# Altium schematic sheet power-v12.SchDoc: Copper Suicide - Power 12V
size Letter; CheckedBy: J. Brinton; CompanyName: Signal Laboratories, Inc.; DrawnBy: J. Brinton; Engineer: J. Brinton; Address1: 3479 Edison Way; Address2: Menlo Park CA 94025; Address3: +1 (877) 778-8435; Address4: siglabs.com; Revision: 3; SheetNumber: 40; SheetTotal: 47
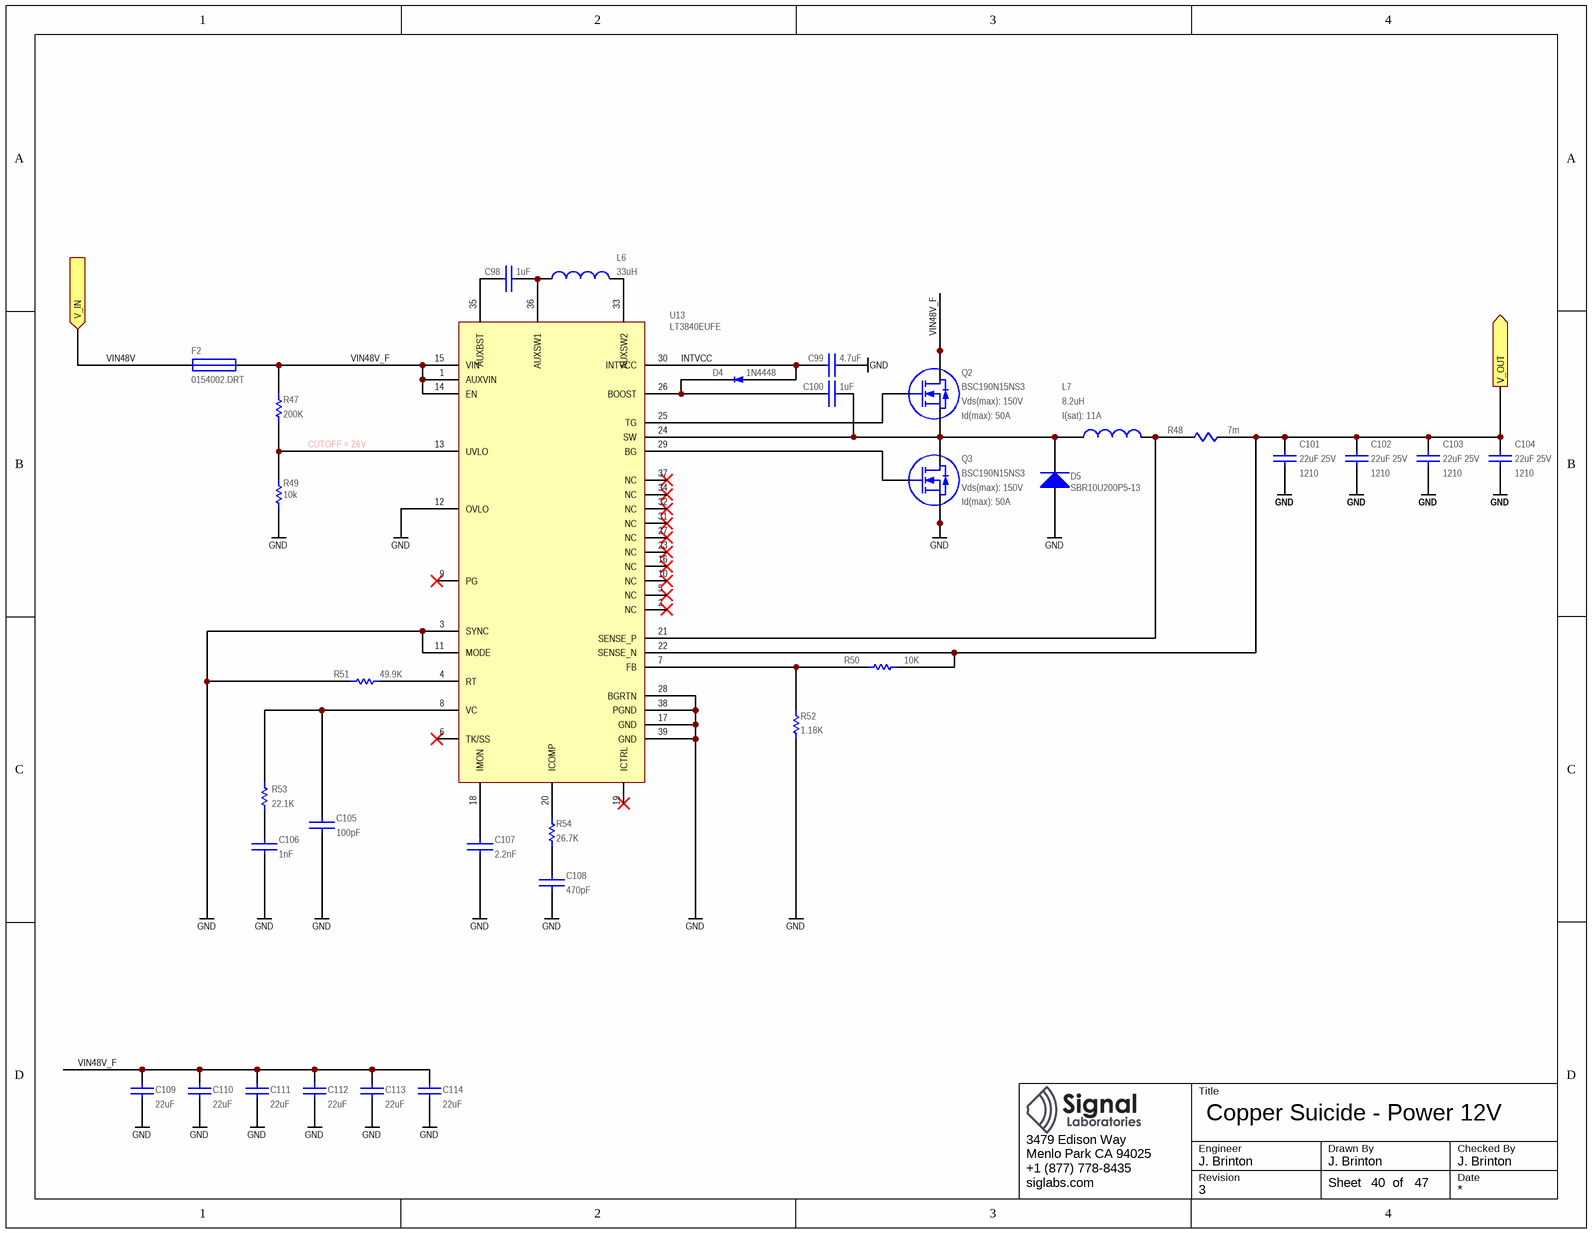
[diagram p0: power-v12.SchDoc]

## Parts
C98  value 1uF  [CAPC100X50X55L25N]  (hidden comment: GRM155R61A105KE15)
C99  value 4.7uF  [CAPC160X80X90L20N]  (hidden comment: GRM188R61E475KE11)
C100  value 1uF  [CAPC100X50X55L25N]  (hidden comment: GRM155R61A105KE15)
C101  value 22uF  Voltage: 25V  Package: 1210  [CAPC320X250X270L50N]  (hidden comment: GRM32ER71E226KE15)
C102  value 22uF  Voltage: 25V  Package: 1210  [CAPC320X250X270L50N]  (hidden comment: GRM32ER71E226KE15)
C103  value 22uF  Voltage: 25V  Package: 1210  [CAPC320X250X270L50N]  (hidden comment: GRM32ER71E226KE15)
C104  value 22uF  Voltage: 25V  Package: 1210  [CAPC320X250X270L50N]  (hidden comment: GRM32ER71E226KE15)
C105  value 100pF  [CAPC100X50X55L25N]  (hidden comment: GRM1555C1H101JA01)
C106  value 1nF  [CAPC100X50X55L25N]  (hidden comment: GRM1555C1H102JA01)
C107  value 2.2nF  [CAPC100X50X55L25N]  (hidden comment: C0402C222J3GACTU)
C108  value 470pF  [CAPC100X50X55L25N]  (hidden comment: GRM155R71H471JA01)
C109  value 22uF  [CAPC600X500X500L160N]  (hidden comment: CKG57NX7S1H226M500JJ)
C110  value 22uF  [CAPC600X500X500L160N]  (hidden comment: CKG57NX7S1H226M500JJ)
C111  value 22uF  [CAPC600X500X500L160N]  (hidden comment: CKG57NX7S1H226M500JJ)
C112  value 22uF  [CAPC600X500X500L160N]  (hidden comment: CKG57NX7S1H226M500JJ)
C113  value 22uF  [CAPC600X500X500L160N]  (hidden comment: CKG57NX7S1H226M500JJ)
C114  value 22uF  [CAPC600X500X500L160N]  (hidden comment: CKG57NX7S1H226M500JJ)
D4  Alternative P/N: 1N4448  [SOD323]  (hidden comment: 1N4448HWS-7-F)
D5  SBR10U200P5-13  [DIODES_POWERDI5]
F2  0154002.DRT  [154]
L6  value 33uH  [ME3220]  (hidden comment: ME3220-333KL)
L7  value 8.2uH  I(sat): 11A  [IND-1350]  (hidden comment: 7443550820)
Q2  BSC190N15NS3  Vds(max): 150V  Id(max): 50A  [TDSON-8]
Q3  BSC190N15NS3  Vds(max): 150V  Id(max): 50A  [TDSON-8]
R47  value 200K  [RESC1005X40N]  (hidden comment: ERJ-2RKF2003X)
R48  value 7m  [RESC3216X80L110N]  (hidden comment: CSR1206-0R007F1)
R49  value 10k  [RESC1005X40N]  (hidden comment: ERJ-2RKF1002X)
R50  value 10K  [RESC1005X40N]  (hidden comment: ERJ-2RKF1002X)
R51  value 49.9K  [RESC1005X40N]  (hidden comment: ERJ-2RKF4992X)
R52  value 1.18K  [RESC1005X40N]  (hidden comment: RC0402FR-071K18L)
R53  value 22.1K  [RESC1005X40N]  (hidden comment: ERJ-2RKF2212X)
R54  value 26.7K  [RESC1005X40N]  (hidden comment: ERJ-2RKF2672X)
U13  LT3840EUFE  [QFN39P40_600X400X80L40X20T465X265N]

## Ports
V_IN (in), V_OUT (out)

## Nets
GND: C99.2 C101.1 C102.1 C103.1 C104.1 C105.1 C106.2 C107.2 C108.1 C109.1 C110.1 C111.1 C112.1 C113.1 C114.1 D5.A Q3.1(S) Q3.2(S) Q3.3(S) R49.1 R51.2 R52.2 U13.3(SYNC) U13.11(MODE) U13.12(OVLO) U13.17(GND) U13.28(BGRTN) U13.38(PGND) U13.39(GND)
INTVCC: C99.1 D4.A U13.30(INTVCC)
V_OUT: C101.2 C102.2 C103.2 C104.2 R48.2 R50.2 U13.22(SENSE_N) ; port V_OUT
VIN48V: F2.1 ; port V_IN
VIN48V_F: C109.2 C110.2 C111.2 C112.2 C113.2 C114.2 F2.2 Q2.5(D) Q2.6(D) Q2.7(D) Q2.8(D) Q2.9(D) R47.2 U13.1(AUXVIN) U13.14(EN) U13.15(VIN)
NetC98_1: C98.1 L6.1 U13.36(AUXSW1)
NetC98_2: C98.2 U13.35(AUXBST)
NetC100_1: C100.1 D5.K L7.1 Q2.1(S) Q2.2(S) Q2.3(S) Q3.5(D) Q3.6(D) Q3.7(D) Q3.8(D) Q3.9(D) U13.24(SW)
NetC100_2: C100.2 D4.K U13.26(BOOST)
NetC105_2: C105.2 R53.2 U13.8(VC)
NetC106_1: C106.1 R53.1
NetC107_1: C107.1 U13.18(IMON)
NetC108_2: C108.2 R54.2
NetL6_2: L6.2 U13.33(AUXSW2)
NetL7_2: L7.2 R48.1 U13.21(SENSE_P)
NetQ2_4: Q2.4(G) U13.25(TG)
NetQ3_4: Q3.4(G) U13.29(BG)
NetR47_1: R47.1 R49.2 U13.13(UVLO)
NetR50_1: R50.1 R52.1 U13.7(FB)
NetR51_1: R51.1 U13.4(RT)
NetR54_1: R54.1 U13.20(ICOMP)

Not connected (* = marked no-connect by the designer): U13 2(NC)* 5(NC)* 6(TK/SS)* 9(PG)* 10(NC)* 16(NC)* 19(ICTRL)* 23(NC)* 27(NC)* 31(NC)* 32(NC)* 34(NC)* 37(NC)*

## Notes on the sheet
- CUTOFF = 26V
- Title
- Engineer
- Revision
- Drawn By
- Checked By
- Date
- Sheet
- of

## Library data of the parts
C98 C100 = CAP: Ceramic Capacitor 1uF ±10% 10V X5R 0402; Manufacturer: Murata; Tr: -55:125; Manufacturer P/N: GRM155R61A105KE15; Package: 0402; Tolerance: ±10%; Voltage: 10V
C99 = CAP 0603: Ceramic Capacitor 4.7uF ±10% 25V X5R 0603; Manufacturer: Murata; Tr: -55:85; Voltage: 25V; Manufacturer P/N: GRM188R61E475KE11; Package: 0603; Tolerance: ±10%
C101-C104 = CAP: Ceramic Capacitor 22uF ±10% 25V X7R 1210; Manufacturer: Murata; Tr: -55:125; Manufacturer P/N: GRM32ER71E226KE15; Tolerance: ±10%
C105 = CAP: Ceramic Capacitor 100pF ±5% 50V NP0 0402; Manufacturer: Murata; Tr: -55:125; Manufacturer P/N: GRM1555C1H101JA01; Voltage: 50V; Package: 0402; Tolerance: ±5%
C106 = CAP: Ceramic Capacitor 1nF ±5% 50V NP0 0402; Manufacturer: Murata; Tr: -55:125; Manufacturer P/N: GRM1555C1H102JA01; Voltage: 50V; Package: 0402; Tolerance: ±5%
C107 = CAP: Ceramic Capacitor 2.2nF ±5% 25V NP0 0402; Manufacturer: Kemet; Tr: -55:125; Manufacturer P/N: C0402C222J3GACTU; Package: 0402; Tolerance: ±5%; Voltage: 25V
C108 = CAP: Ceramic Capacitor 470pF ±5% 50V X7R 0402; Manufacturer: Murata; Tr: -55:125; Manufacturer P/N: GRM155R71H471JA01; Voltage: 50V; Package: 0402; Tolerance: ±5%
C109-C114 = CAP: Ceramic Capacitor 22uF ±20% 50V X7S Stacked; Manufacturer: TDK; Tr: -55:125; Manufacturer P/N: CKG57NX7S1H226M500JJ; Tolerance: ±20%; Voltage: 50V; Package: 3025
D4 = 1N4448HWS-7-F: Schottky Diode 80V 250mA SOD323; Manufacturer: Diodes, Inc.; Manufacturer P/N: 1N4448HWS-7-F; Package: SOD323
D5 = PDS5100H: Schottky Diode 200V 10A SMD; Manufacturer: Diodes Inc; Manufacturer P/N: SBR10U200P5-13; Current: 10A; Reverse Voltage (max): 200V
F2 = Fuse 1: 154 OMNI-BLOK 2A Fuse and Holder; Manufacturer: Littelfuse; Manufacturer P/N: 0154002.DRT
L6 = COIL: Wirewound Power Inductor 33uH ±10% 500mA SMD; Manufacturer: Coilcraft; Tr: -40:85; Manufacturer P/N: ME3220-333KL; I(sat): 500mA; Package: *; Tolerance: ±10%
L7 = COIL: Fixed Inductor 8.2uH, 11A(sat), SMD; Manufacturer: Wurth Electronics; Manufacturer P/N: 7443550820
Q2 Q3 = BSC190N15NS3: MOSFET N-Channel Enhancement Mode; Manufacturer: Infineon; Rds(on): 19mOhm; Manufacturer P/N: BSC190N15NS3
R47 = RES 0402: Thick Film Resistor 200k ±1% 0402; Manufacturer: Panasonic; Tr: -55:155; Package: 0402; Manufacturer P/N: ERJ-2RKF2003X; Tolerance: ±1%
R48 = CSR1206-0R001F1: Current Sense Resistor 7mOhm +/-1% SMD 1206; Manufacturer: Riedon; Manufacturer P/N: CSR1206-0R007F1; Package: 1206
R49 = RES: Thick Film Resistor 10k ±1% 0.1W 50V 0402; Manufacturer: Panasonic; Tcr: ±100; Tr: -55:155; Voltage: 50; Power: 0.1; Manufacturer P/N: ERJ-2RKF1002X; Tolerance: ±1%; Alternatives: *; Footprint: *; Package: 0402
R50 = RES 0402: Thick Film Resistor 10k ±1% 0.1W 50V 0402; Manufacturer: Panasonic; Tr: -55:155; Package: 0402; Manufacturer P/N: ERJ-2RKF1002X; Tolerance: ±1%
R51 = RES 0402: Thick Film 49.9k ±1% 0402; Manufacturer: Panasonic; Tr: -55:155; Package: 0402; Manufacturer P/N: ERJ-2RKF4992X; Tolerance: ±1%
R52 = RES 0402: Thick Film Resistor 1.18k ±1% 0402; Manufacturer: Yageo; Tr: -55:155; Package: 0402; Manufacturer P/N: RC0402FR-071K18L; Tolerance: ±1%
R53 = RES 0402: Thick Film Resistor 22.1k ±1% 0402; Manufacturer: Panasonic; Tr: -55:155; Package: 0402; Manufacturer P/N: ERJ-2RKF2212X; Tolerance: ±1%
R54 = RES 0402: Thick Film Resistor 26.7k ±1% 0402; Manufacturer: Panasonic; Tr: -55:155; Package: 0402; Manufacturer P/N: ERJ-2RKF2672X; Tolerance: ±1%
U13 = LT3840EUFE: Synchronous Regulator Controller; Manufacturer: Linear Technologies; Alternative P/N: LT3840IUFE; Manufacturer P/N: LT3840EUFE